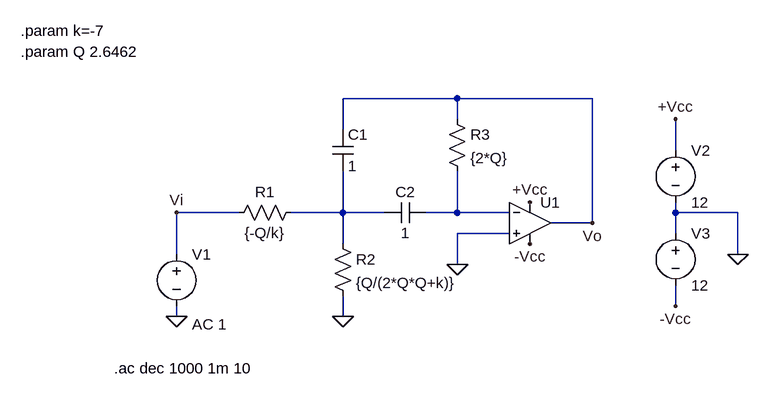
[diagram p0: schematic Tplab1_MFB_Normalizado.asc]
Tplab1_MFB_Normalizado.asc, the LTspice schematic file:
Version 4.1
SHEET 1 880 680
WIRE 288 -32 112 -32
WIRE 496 -32 288 -32
WIRE 288 0 288 -32
WIRE 112 16 112 -32
WIRE 624 48 624 0
WIRE -48 144 -144 144
WIRE 112 144 112 80
WIRE 112 144 32 144
WIRE 176 144 112 144
WIRE 288 144 288 80
WIRE 288 144 240 144
WIRE 368 144 288 144
WIRE 624 144 624 128
WIRE 720 144 624 144
WIRE 496 160 496 -32
WIRE 496 160 432 160
WIRE 368 176 288 176
WIRE 624 176 624 144
WIRE 112 192 112 144
WIRE -144 208 -144 144
WIRE 720 208 720 144
WIRE 288 224 288 176
WIRE 624 288 624 256
WIRE -144 304 -144 288
WIRE 112 304 112 272
FLAG 288 224 0
FLAG 112 304 0
FLAG -144 304 0
FLAG 720 208 0
FLAG 624 0 +Vcc
FLAG 400 128 +Vcc
FLAG 624 288 -Vcc
FLAG 400 192 -Vcc
FLAG -144 144 Vi
FLAG 496 160 Vo
SYMBOL res 48 128 R90
WINDOW 0 0 56 VBottom 2
WINDOW 3 32 56 VTop 2
SYMATTR InstName R1
SYMATTR Value {-Q/k}
SYMBOL res 96 176 R0
SYMATTR InstName R2
SYMATTR Value {Q/(2*Q*Q+k)}
SYMBOL res 272 -16 R0
SYMATTR InstName R3
SYMATTR Value {2*Q}
SYMBOL cap 96 16 R0
SYMATTR InstName C1
SYMATTR Value 1
SYMBOL cap 240 128 R90
WINDOW 0 0 32 VBottom 2
WINDOW 3 32 32 VTop 2
SYMATTR InstName C2
SYMATTR Value 1
SYMBOL OpAmps\\UniversalOpAmp 400 160 R0
SYMATTR InstName U1
SYMBOL voltage 624 32 R0
WINDOW 123 0 0 Left 0
WINDOW 39 0 0 Left 0
SYMATTR InstName V2
SYMATTR Value 12
SYMBOL voltage 624 160 R0
WINDOW 123 0 0 Left 0
WINDOW 39 0 0 Left 0
SYMATTR InstName V3
SYMATTR Value 12
SYMBOL voltage -144 192 R0
WINDOW 123 24 124 Left 2
WINDOW 39 0 0 Left 0
SYMATTR Value2 AC 1
SYMATTR InstName V1
SYMATTR Value ""
TEXT -384 -104 Left 2 !.param Q 2.6462
TEXT -384 -136 Left 2 !.param k=-7
TEXT -240 384 Left 2 !.ac dec 1000 1m 10

The netlist it stands for:
* Tplab1_MFB_Normalizado.asc
R1 N001 Vi {-Q/k}
R2 N001 0 {Q/(2*Q*Q+k)}
R3 Vo N002 {2*Q}
C1 Vo N001 1
C2 N002 N001 1
X§U1 0 N002 +Vcc -Vcc Vo level1 Avol=1Meg GBW=10Meg Vos=0 En=0 Enk=0 In=0 Ink=0 Rin=500Meg  ; pins In+ In- V+ V- OUT
V2 +Vcc 0 12
V3 0 -Vcc 12
V1 Vi 0 AC 1
.param Q 2.6462
.param k=-7
.ac dec 1000 1m 10
.lib UniversalOpAmp1.lib
.backanno
.end